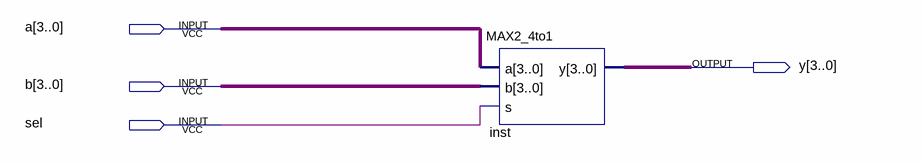
[diagram p0: schematic sheet]
// Quartus schematic Block1.bdf as structural Verilog: 1 symbols, 4 pins
module Block1 (
  input  [3:0] a,
  input  [3:0] b,
  input  sel,
  output [3:0] y
);

  MAX2_4to1 inst (.a(a), .b(b), .s(sel), .y(y));
endmodule
